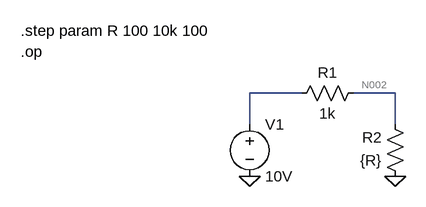
[diagram p0: schematic Comando Step op.asc]
Comando Step op.asc, the LTspice schematic file:
Version 4
SHEET 1 880 680
WIRE 144 80 64 80
WIRE 288 80 224 80
WIRE 64 128 64 80
WIRE 288 128 288 80
FLAG 64 208 0
FLAG 288 208 0
SYMBOL voltage 64 112 R0
WINDOW 123 0 0 Left 0
WINDOW 39 0 0 Left 0
SYMATTR InstName V1
SYMATTR Value 10V
SYMBOL res 240 64 R90
WINDOW 0 0 56 VBottom 2
WINDOW 3 32 56 VTop 2
SYMATTR InstName R1
SYMATTR Value 1k
SYMBOL res 304 224 R180
WINDOW 0 36 76 Left 2
WINDOW 3 36 40 Left 2
SYMATTR InstName R2
SYMATTR Value {R}
TEXT -288 -16 Left 2 !.step param R 100 10k 100
TEXT -288 16 Left 2 !.op

The netlist it stands for:
* Comando Step op.asc
V1 N001 0 10V
R1 N002 N001 1k
R2 0 N002 {R}
.step param R 100 10k 100
.op
.backanno
.end

* Results of the author's LTspice run, read from the files saved beside the schematic
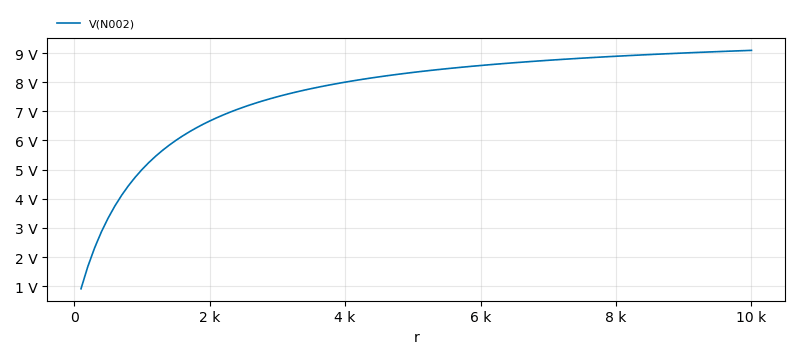
[diagram p1: Operating Point of Comando Step op.asc, plotted from the saved traces]
* Operating Point, 1 run:
*   V(N002): 909.1 mV at r=100 , 9.091 V at r=10 k, min 909.1 mV, max 9.091 V